# Altium project STMCUBE.PrjPCB
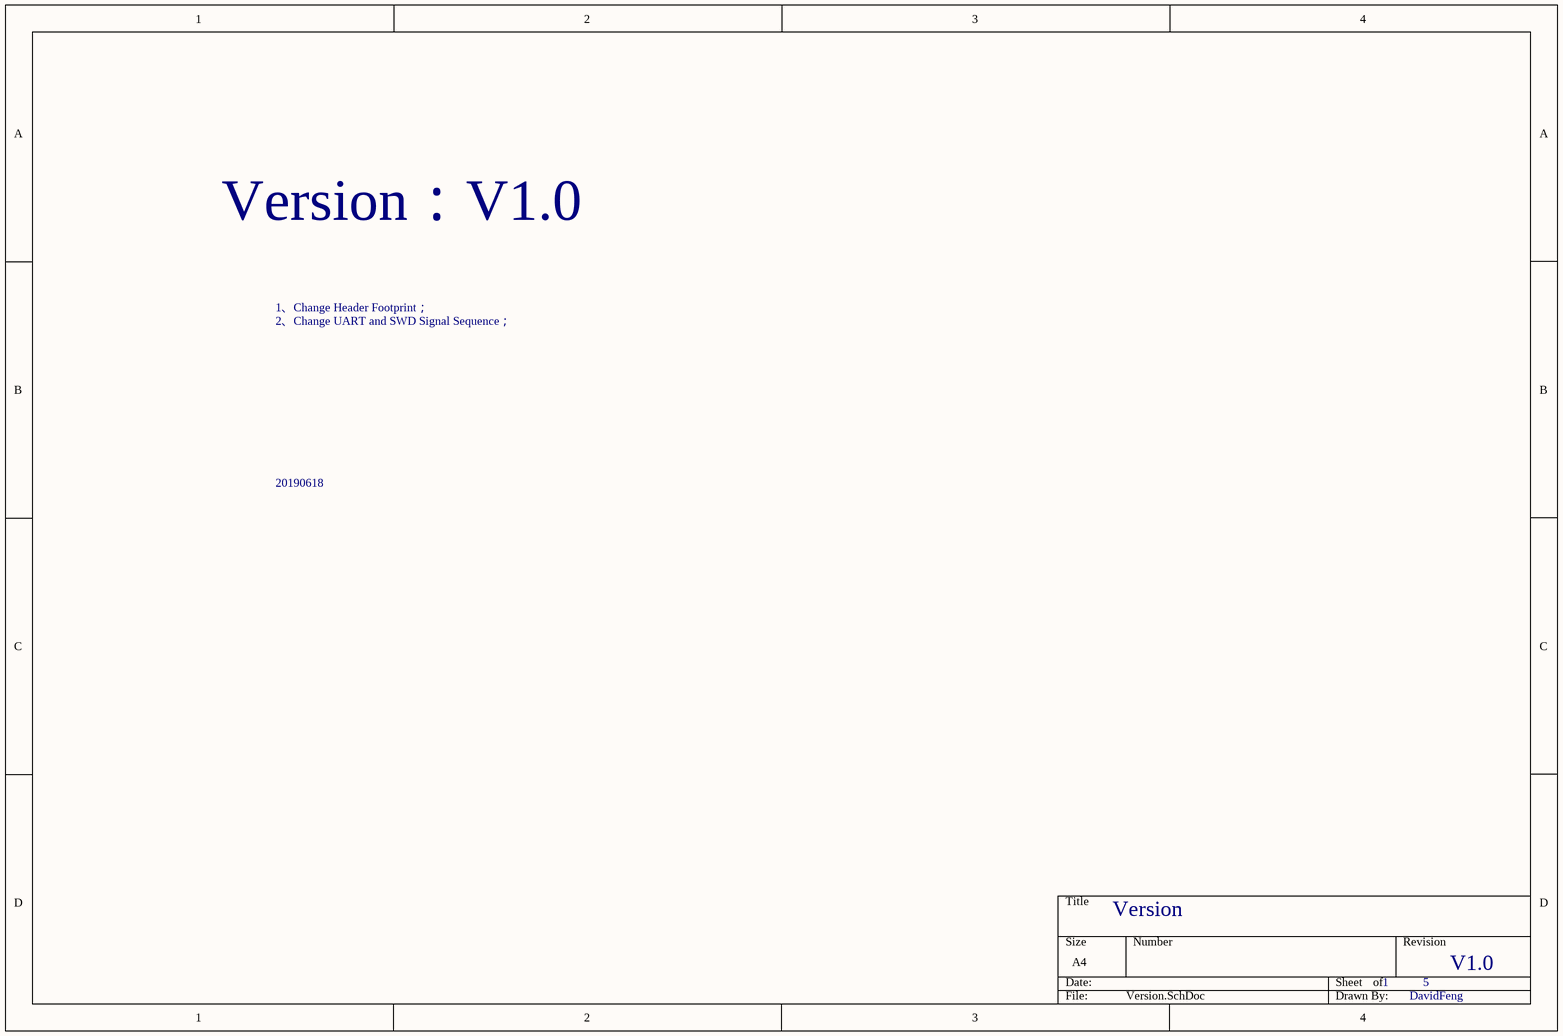
[diagram p0: Version.SchDoc]
5 sheets, 52 parts. Net scope: global (net labels, ports and power ports of the same name join across sheets).
Board file: STMCUBE.PcbDoc
Sheets:
  Version.SchDoc
  MCU.SchDoc
  POWER.SchDoc
  Peripheral.SchDoc
  Connectors.SchDoc

## Sheet Version.SchDoc
size A4

### Notes on the sheet
- Version：V1.0
- 1、Change Header Footprint；
- 2、Change UART and SWD Signal Sequence；
- 20190618
- Version
- 1
- 5
- V1.0
- DavidFeng

## Sheet MCU.SchDoc
size A3
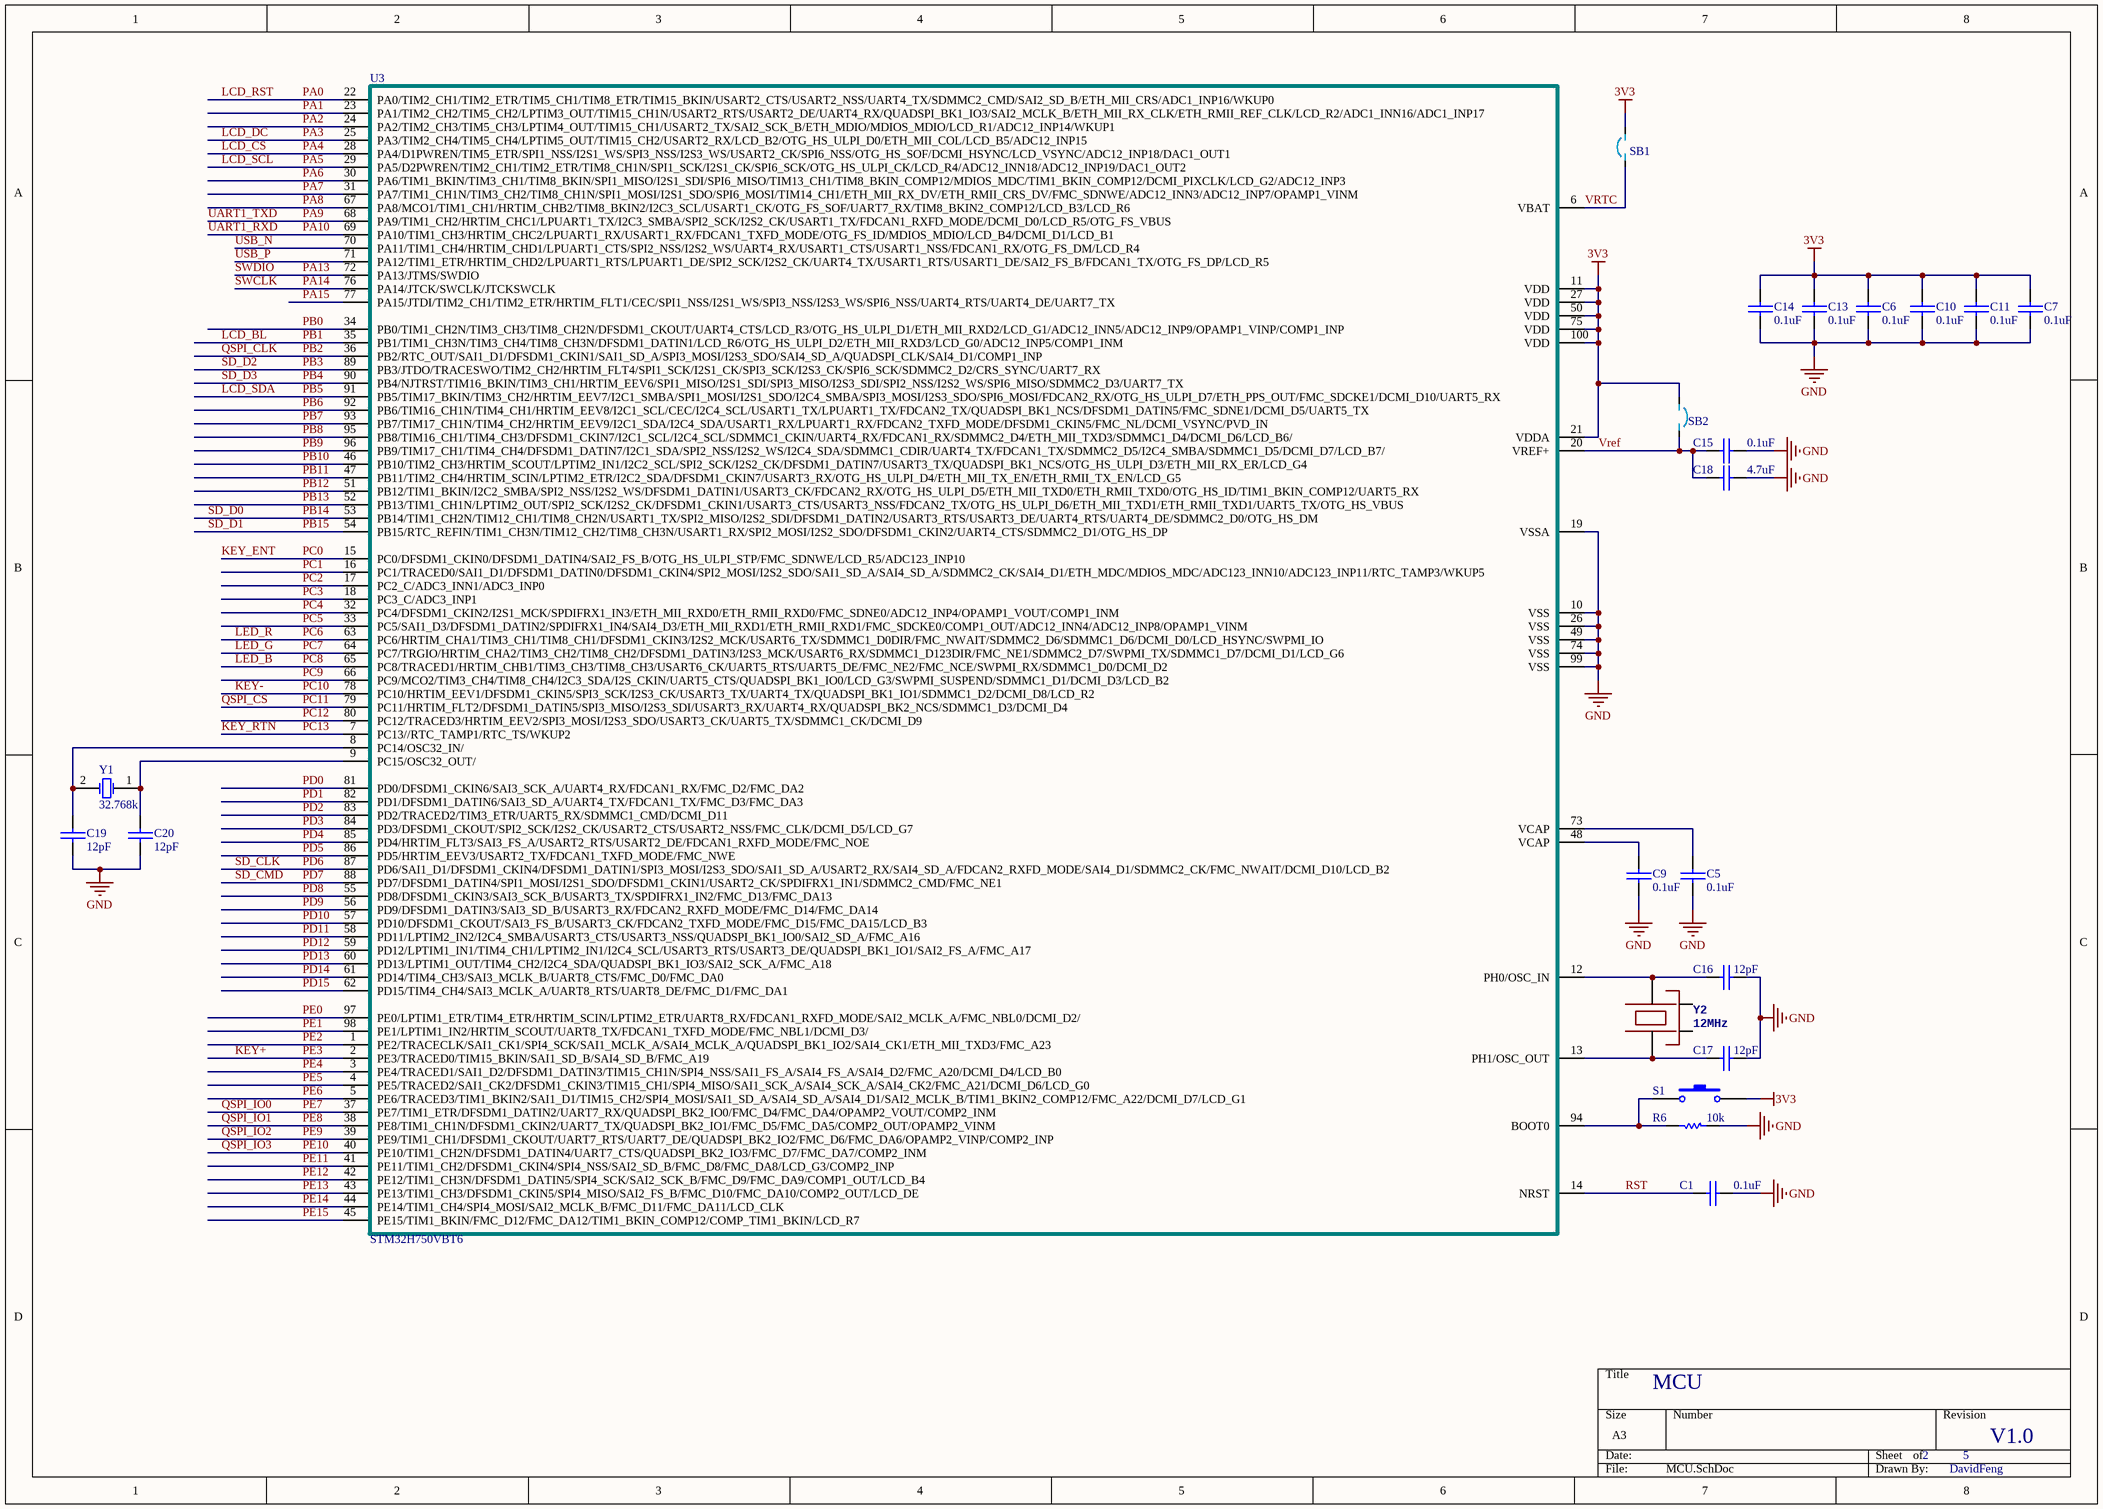
[diagram p1: MCU.SchDoc]

### Parts
C1  0.1uF  [C0603]
C5  0.1uF  [C0603]
C6  0.1uF  [C0603]
C7  0.1uF  [C0603]
C9  0.1uF  [C0603]
C10  0.1uF  [C0603]
C11  0.1uF  [C0603]
C13  0.1uF  [C0603]
C14  0.1uF  [C0603]
C15  0.1uF  [C0603]
C16  12pF  [C0603]
C17  12pF  [C0603]
C18  4.7uF  [C0805]
C19  12pF  [C0603]
C20  12pF  [C0603]
R6  10k  [R0603]
S1  SW-PB  [SW_4X7_2P]  (value not drawn)
SB1  Jumper  [SB0603]  (value not drawn)
SB2  Jumper  [SB0603]  (value not drawn)
U3  STM32H750VBT6  [TQFP-100]
Y1  32.768k  [FC-135]
Y2  12MHz  [SMD-3225]

### Nets
3V3: C6.1 C7.1 C10.2 C11.1 C13.2 C14.2 S1.2 SB1.1 SB2.2 U3.11(VDD) U3.21(VDDA) U3.27(VDD) U3.50(VDD) U3.75(VDD) U3.100(VDD)
GND: C1.2 C5.2 C6.2 C7.2 C9.2 C10.1 C11.2 C13.1 C14.1 C15.2 C16.1 C17.1 C18.2 C19.1 C20.1 R6.2 U3.10(VSS) U3.19(VSSA) U3.26(VSS) U3.49(VSS) U3.74(VSS) U3.99(VSS)
KEY+: U3.2(PE3/TRACED0/TIM15_BKIN/SAI1_SD_B/SAI4_SD_B/FMC_A19)  [also labelled PE3]
KEY-: U3.78(PC10/HRTIM_EEV1/DFSDM1_CKIN5/SPI3_SCK/I2S3_CK/USART3_TX/UART4_TX/QUADSPI_BK1_IO1/SDMMC1_D2/DCMI_D8/LCD_R2)  [also labelled PC10]
KEY_ENT: U3.15(PC0/DFSDM1_CKIN0/DFSDM1_DATIN4/SAI2_FS_B/OTG_HS_ULPI_STP/FMC_SDNWE/LCD_R5/ADC123_INP10)  [also labelled PC0]
KEY_RTN: U3.7(PC13//RTC_TAMP1/RTC_TS/WKUP2)  [also labelled PC13]
LCD_BL: U3.35(PB1/TIM1_CH3N/TIM3_CH4/TIM8_CH3N/DFSDM1_DATIN1/LCD_R6/OTG_HS_ULPI_D2/ETH_MII_RXD3/LCD_G0/ADC12_INP5/COMP1_INM)  [also labelled PB1]
LCD_CS: U3.28(PA4/D1PWREN/TIM5_ETR/SPI1_NSS/I2S1_WS/SPI3_NSS/I2S3_WS/USART2_CK/SPI6_NSS/OTG_HS_SOF/DCMI_HSYNC/LCD_VSYNC/ADC12_INP18/DAC1_OUT1)  [also labelled PA4]
LCD_DC: U3.25(PA3/TIM2_CH4/TIM5_CH4/LPTIM5_OUT/TIM15_CH2/USART2_RX/LCD_B2/OTG_HS_ULPI_D0/ETH_MII_COL/LCD_B5/ADC12_INP15)  [also labelled PA3]
LCD_RST: U3.22(PA0/TIM2_CH1/TIM2_ETR/TIM5_CH1/TIM8_ETR/TIM15_BKIN/USART2_CTS/USART2_NSS/UART4_TX/SDMMC2_CMD/SAI2_SD_B/ETH_MII_CRS/ADC1_INP16/WKUP0)  [also labelled PA0]
LCD_SCL: U3.29(PA5/D2PWREN/TIM2_CH1/TIM2_ETR/TIM8_CH1N/SPI1_SCK/I2S1_CK/SPI6_SCK/OTG_HS_ULPI_CK/LCD_R4/ADC12_INN18/ADC12_INP19/DAC1_OUT2)  [also labelled PA5]
LCD_SDA: U3.91(PB5/TIM17_BKIN/TIM3_CH2/HRTIM_EEV7/I2C1_SMBA/SPI1_MOSI/I2S1_SDO/I2C4_SMBA/SPI3_MOSI/I2S3_SDO/SPI6_MOSI/FDCAN2_RX/OTG_HS_ULPI_D7/ETH_PPS_OUT/FMC_SDCKE1/DCMI_D10/UART5_RX)  [also labelled PB5]
LED_B: U3.65(PC8/TRACED1/HRTIM_CHB1/TIM3_CH3/TIM8_CH3/USART6_CK/UART5_RTS/UART5_DE/FMC_NE2/FMC_NCE/SWPMI_RX/SDMMC1_D0/DCMI_D2)  [also labelled PC8]
LED_G: U3.64(PC7/TRGIO/HRTIM_CHA2/TIM3_CH2/TIM8_CH2/DFSDM1_DATIN3/I2S3_MCK/USART6_RX/SDMMC1_D123DIR/FMC_NE1/SDMMC2_D7/SWPMI_TX/SDMMC1_D7/DCMI_D1/LCD_G6)  [also labelled PC7]
LED_R: U3.63(PC6/HRTIM_CHA1/TIM3_CH1/TIM8_CH1/DFSDM1_CKIN3/I2S2_MCK/USART6_TX/SDMMC1_D0DIR/FMC_NWAIT/SDMMC2_D6/SDMMC1_D6/DCMI_D0/LCD_HSYNC/SWPMI_IO)  [also labelled PC6]
PA1: U3.23(PA1/TIM2_CH2/TIM5_CH2/LPTIM3_OUT/TIM15_CH1N/USART2_RTS/USART2_DE/UART4_RX/QUADSPI_BK1_IO3/SAI2_MCLK_B/ETH_MII_RX_CLK/ETH_RMII_REF_CLK/LCD_R2/ADC1_INN16/ADC1_INP17)
PA2: U3.24(PA2/TIM2_CH3/TIM5_CH3/LPTIM4_OUT/TIM15_CH1/USART2_TX/SAI2_SCK_B/ETH_MDIO/MDIOS_MDIO/LCD_R1/ADC12_INP14/WKUP1)
PA6: U3.30(PA6/TIM1_BKIN/TIM3_CH1/TIM8_BKIN/SPI1_MISO/I2S1_SDI/SPI6_MISO/TIM13_CH1/TIM8_BKIN_COMP12/MDIOS_MDC/TIM1_BKIN_COMP12/DCMI_PIXCLK/LCD_G2/ADC12_INP3)
PA7: U3.31(PA7/TIM1_CH1N/TIM3_CH2/TIM8_CH1N/SPI1_MOSI/I2S1_SDO/SPI6_MOSI/TIM14_CH1/ETH_MII_RX_DV/ETH_RMII_CRS_DV/FMC_SDNWE/ADC12_INN3/ADC12_INP7/OPAMP1_VINM)
PA8: U3.67(PA8/MCO1/TIM1_CH1/HRTIM_CHB2/TIM8_BKIN2/I2C3_SCL/USART1_CK/OTG_FS_SOF/UART7_RX/TIM8_BKIN2_COMP12/LCD_B3/LCD_R6)
PA9: U3.68(PA9/TIM1_CH2/HRTIM_CHC1/LPUART1_TX/I2C3_SMBA/SPI2_SCK/I2S2_CK/USART1_TX/FDCAN1_RXFD_MODE/DCMI_D0/LCD_R5/OTG_FS_VBUS)  [also labelled UART1_TXD]
PA10: U3.69(PA10/TIM1_CH3/HRTIM_CHC2/LPUART1_RX/USART1_RX/FDCAN1_TXFD_MODE/OTG_FS_ID/MDIOS_MDIO/LCD_B4/DCMI_D1/LCD_B1)  [also labelled UART1_RXD]
PA13: U3.72(PA13/JTMS/SWDIO)  [also labelled SWDIO]
PA14: U3.76(PA14/JTCK/SWCLK/JTCKSWCLK)  [also labelled SWCLK]
PA15: U3.77(PA15/JTDI/TIM2_CH1/TIM2_ETR/HRTIM_FLT1/CEC/SPI1_NSS/I2S1_WS/SPI3_NSS/I2S3_WS/SPI6_NSS/UART4_RTS/UART4_DE/UART7_TX)
PB0: U3.34(PB0/TIM1_CH2N/TIM3_CH3/TIM8_CH2N/DFSDM1_CKOUT/UART4_CTS/LCD_R3/OTG_HS_ULPI_D1/ETH_MII_RXD2/LCD_G1/ADC12_INN5/ADC12_INP9/OPAMP1_VINP/COMP1_INP)
PB2: U3.36(PB2/RTC_OUT/SAI1_D1/DFSDM1_CKIN1/SAI1_SD_A/SPI3_MOSI/I2S3_SDO/SAI4_SD_A/QUADSPI_CLK/SAI4_D1/COMP1_INP)  [also labelled QSPI_CLK]
PB3: U3.89(PB3/JTDO/TRACESWO/TIM2_CH2/HRTIM_FLT4/SPI1_SCK/I2S1_CK/SPI3_SCK/I2S3_CK/SPI6_SCK/SDMMC2_D2/CRS_SYNC/UART7_RX)  [also labelled SD_D2]
PB4: U3.90(PB4/NJTRST/TIM16_BKIN/TIM3_CH1/HRTIM_EEV6/SPI1_MISO/I2S1_SDI/SPI3_MISO/I2S3_SDI/SPI2_NSS/I2S2_WS/SPI6_MISO/SDMMC2_D3/UART7_TX)  [also labelled SD_D3]
PB6: U3.92(PB6/TIM16_CH1N/TIM4_CH1/HRTIM_EEV8/I2C1_SCL/CEC/I2C4_SCL/USART1_TX/LPUART1_TX/FDCAN2_TX/QUADSPI_BK1_NCS/DFSDM1_DATIN5/FMC_SDNE1/DCMI_D5/UART5_TX)
PB7: U3.93(PB7/TIM17_CH1N/TIM4_CH2/HRTIM_EEV9/I2C1_SDA/I2C4_SDA/USART1_RX/LPUART1_RX/FDCAN2_TXFD_MODE/DFSDM1_CKIN5/FMC_NL/DCMI_VSYNC/PVD_IN)
PB8: U3.95(PB8/TIM16_CH1/TIM4_CH3/DFSDM1_CKIN7/I2C1_SCL/I2C4_SCL/SDMMC1_CKIN/UART4_RX/FDCAN1_RX/SDMMC2_D4/ETH_MII_TXD3/SDMMC1_D4/DCMI_D6/LCD_B6/)
PB9: U3.96(PB9/TIM17_CH1/TIM4_CH4/DFSDM1_DATIN7/I2C1_SDA/SPI2_NSS/I2S2_WS/I2C4_SDA/SDMMC1_CDIR/UART4_TX/FDCAN1_TX/SDMMC2_D5/I2C4_SMBA/SDMMC1_D5/DCMI_D7/LCD_B7/)
PB10: U3.46(PB10/TIM2_CH3/HRTIM_SCOUT/LPTIM2_IN1/I2C2_SCL/SPI2_SCK/I2S2_CK/DFSDM1_DATIN7/USART3_TX/QUADSPI_BK1_NCS/OTG_HS_ULPI_D3/ETH_MII_RX_ER/LCD_G4)
PB11: U3.47(PB11/TIM2_CH4/HRTIM_SCIN/LPTIM2_ETR/I2C2_SDA/DFSDM1_CKIN7/USART3_RX/OTG_HS_ULPI_D4/ETH_MII_TX_EN/ETH_RMII_TX_EN/LCD_G5)
PB12: U3.51(PB12/TIM1_BKIN/I2C2_SMBA/SPI2_NSS/I2S2_WS/DFSDM1_DATIN1/USART3_CK/FDCAN2_RX/OTG_HS_ULPI_D5/ETH_MII_TXD0/ETH_RMII_TXD0/OTG_HS_ID/TIM1_BKIN_COMP12/UART5_RX)
PB13: U3.52(PB13/TIM1_CH1N/LPTIM2_OUT/SPI2_SCK/I2S2_CK/DFSDM1_CKIN1/USART3_CTS/USART3_NSS/FDCAN2_TX/OTG_HS_ULPI_D6/ETH_MII_TXD1/ETH_RMII_TXD1/UART5_TX/OTG_HS_VBUS)
PB14: U3.53(PB14/TIM1_CH2N/TIM12_CH1/TIM8_CH2N/USART1_TX/SPI2_MISO/I2S2_SDI/DFSDM1_DATIN2/USART3_RTS/USART3_DE/UART4_RTS/UART4_DE/SDMMC2_D0/OTG_HS_DM)  [also labelled SD_D0]
PB15: U3.54(PB15/RTC_REFIN/TIM1_CH3N/TIM12_CH2/TIM8_CH3N/USART1_RX/SPI2_MOSI/I2S2_SDO/DFSDM1_CKIN2/UART4_CTS/SDMMC2_D1/OTG_HS_DP)  [also labelled SD_D1]
PC1: U3.16(PC1/TRACED0/SAI1_D1/DFSDM1_DATIN0/DFSDM1_CKIN4/SPI2_MOSI/I2S2_SDO/SAI1_SD_A/SAI4_SD_A/SDMMC2_CK/SAI4_D1/ETH_MDC/MDIOS_MDC/ADC123_INN10/ADC123_INP11/RTC_TAMP3/WKUP5)
PC2: U3.17(PC2_C/ADC3_INN1/ADC3_INP0)
PC3: U3.18(PC3_C/ADC3_INP1)
PC4: U3.32(PC4/DFSDM1_CKIN2/I2S1_MCK/SPDIFRX1_IN3/ETH_MII_RXD0/ETH_RMII_RXD0/FMC_SDNE0/ADC12_INP4/OPAMP1_VOUT/COMP1_INM)
PC5: U3.33(PC5/SAI1_D3/DFSDM1_DATIN2/SPDIFRX1_IN4/SAI4_D3/ETH_MII_RXD1/ETH_RMII_RXD1/FMC_SDCKE0/COMP1_OUT/ADC12_INN4/ADC12_INP8/OPAMP1_VINM)
PC9: U3.66(PC9/MCO2/TIM3_CH4/TIM8_CH4/I2C3_SDA/I2S_CKIN/UART5_CTS/QUADSPI_BK1_IO0/LCD_G3/SWPMI_SUSPEND/SDMMC1_D1/DCMI_D3/LCD_B2)
PC11: U3.79(PC11/HRTIM_FLT2/DFSDM1_DATIN5/SPI3_MISO/I2S3_SDI/USART3_RX/UART4_RX/QUADSPI_BK2_NCS/SDMMC1_D3/DCMI_D4)  [also labelled QSPI_CS]
PC12: U3.80(PC12/TRACED3/HRTIM_EEV2/SPI3_MOSI/I2S3_SDO/USART3_CK/UART5_TX/SDMMC1_CK/DCMI_D9)
PD0: U3.81(PD0/DFSDM1_CKIN6/SAI3_SCK_A/UART4_RX/FDCAN1_RX/FMC_D2/FMC_DA2)
PD1: U3.82(PD1/DFSDM1_DATIN6/SAI3_SD_A/UART4_TX/FDCAN1_TX/FMC_D3/FMC_DA3)
PD2: U3.83(PD2/TRACED2/TIM3_ETR/UART5_RX/SDMMC1_CMD/DCMI_D11)
PD3: U3.84(PD3/DFSDM1_CKOUT/SPI2_SCK/I2S2_CK/USART2_CTS/USART2_NSS/FMC_CLK/DCMI_D5/LCD_G7)
PD4: U3.85(PD4/HRTIM_FLT3/SAI3_FS_A/USART2_RTS/USART2_DE/FDCAN1_RXFD_MODE/FMC_NOE)
PD5: U3.86(PD5/HRTIM_EEV3/USART2_TX/FDCAN1_TXFD_MODE/FMC_NWE)
PD6: U3.87(PD6/SAI1_D1/DFSDM1_CKIN4/DFSDM1_DATIN1/SPI3_MOSI/I2S3_SDO/SAI1_SD_A/USART2_RX/SAI4_SD_A/FDCAN2_RXFD_MODE/SAI4_D1/SDMMC2_CK/FMC_NWAIT/DCMI_D10/LCD_B2)  [also labelled SD_CLK]
PD7: U3.88(PD7/DFSDM1_DATIN4/SPI1_MOSI/I2S1_SDO/DFSDM1_CKIN1/USART2_CK/SPDIFRX1_IN1/SDMMC2_CMD/FMC_NE1)  [also labelled SD_CMD]
PD8: U3.55(PD8/DFSDM1_CKIN3/SAI3_SCK_B/USART3_TX/SPDIFRX1_IN2/FMC_D13/FMC_DA13)
PD9: U3.56(PD9/DFSDM1_DATIN3/SAI3_SD_B/USART3_RX/FDCAN2_RXFD_MODE/FMC_D14/FMC_DA14)
PD10: U3.57(PD10/DFSDM1_CKOUT/SAI3_FS_B/USART3_CK/FDCAN2_TXFD_MODE/FMC_D15/FMC_DA15/LCD_B3)
PD11: U3.58(PD11/LPTIM2_IN2/I2C4_SMBA/USART3_CTS/USART3_NSS/QUADSPI_BK1_IO0/SAI2_SD_A/FMC_A16)
PD12: U3.59(PD12/LPTIM1_IN1/TIM4_CH1/LPTIM2_IN1/I2C4_SCL/USART3_RTS/USART3_DE/QUADSPI_BK1_IO1/SAI2_FS_A/FMC_A17)
PD13: U3.60(PD13/LPTIM1_OUT/TIM4_CH2/I2C4_SDA/QUADSPI_BK1_IO3/SAI2_SCK_A/FMC_A18)
PD14: U3.61(PD14/TIM4_CH3/SAI3_MCLK_B/UART8_CTS/FMC_D0/FMC_DA0)
PD15: U3.62(PD15/TIM4_CH4/SAI3_MCLK_A/UART8_RTS/UART8_DE/FMC_D1/FMC_DA1)
PE0: U3.97(PE0/LPTIM1_ETR/TIM4_ETR/HRTIM_SCIN/LPTIM2_ETR/UART8_RX/FDCAN1_RXFD_MODE/SAI2_MCLK_A/FMC_NBL0/DCMI_D2/)
PE1: U3.98(PE1/LPTIM1_IN2/HRTIM_SCOUT/UART8_TX/FDCAN1_TXFD_MODE/FMC_NBL1/DCMI_D3/)
PE2: U3.1(PE2/TRACECLK/SAI1_CK1/SPI4_SCK/SAI1_MCLK_A/SAI4_MCLK_A/QUADSPI_BK1_IO2/SAI4_CK1/ETH_MII_TXD3/FMC_A23)
PE4: U3.3(PE4/TRACED1/SAI1_D2/DFSDM1_DATIN3/TIM15_CH1N/SPI4_NSS/SAI1_FS_A/SAI4_FS_A/SAI4_D2/FMC_A20/DCMI_D4/LCD_B0)
PE5: U3.4(PE5/TRACED2/SAI1_CK2/DFSDM1_CKIN3/TIM15_CH1/SPI4_MISO/SAI1_SCK_A/SAI4_SCK_A/SAI4_CK2/FMC_A21/DCMI_D6/LCD_G0)
PE6: U3.5(PE6/TRACED3/TIM1_BKIN2/SAI1_D1/TIM15_CH2/SPI4_MOSI/SAI1_SD_A/SAI4_SD_A/SAI4_D1/SAI2_MCLK_B/TIM1_BKIN2_COMP12/FMC_A22/DCMI_D7/LCD_G1)
PE7: U3.37(PE7/TIM1_ETR/DFSDM1_DATIN2/UART7_RX/QUADSPI_BK2_IO0/FMC_D4/FMC_DA4/OPAMP2_VOUT/COMP2_INM)  [also labelled QSPI_IO0]
PE8: U3.38(PE8/TIM1_CH1N/DFSDM1_CKIN2/UART7_TX/QUADSPI_BK2_IO1/FMC_D5/FMC_DA5/COMP2_OUT/OPAMP2_VINM)  [also labelled QSPI_IO1]
PE9: U3.39(PE9/TIM1_CH1/DFSDM1_CKOUT/UART7_RTS/UART7_DE/QUADSPI_BK2_IO2/FMC_D6/FMC_DA6/OPAMP2_VINP/COMP2_INP)  [also labelled QSPI_IO2]
PE10: U3.40(PE10/TIM1_CH2N/DFSDM1_DATIN4/UART7_CTS/QUADSPI_BK2_IO3/FMC_D7/FMC_DA7/COMP2_INM)  [also labelled QSPI_IO3]
PE11: U3.41(PE11/TIM1_CH2/DFSDM1_CKIN4/SPI4_NSS/SAI2_SD_B/FMC_D8/FMC_DA8/LCD_G3/COMP2_INP)
PE12: U3.42(PE12/TIM1_CH3N/DFSDM1_DATIN5/SPI4_SCK/SAI2_SCK_B/FMC_D9/FMC_DA9/COMP1_OUT/LCD_B4)
PE13: U3.43(PE13/TIM1_CH3/DFSDM1_CKIN5/SPI4_MISO/SAI2_FS_B/FMC_D10/FMC_DA10/COMP2_OUT/LCD_DE)
PE14: U3.44(PE14/TIM1_CH4/SPI4_MOSI/SAI2_MCLK_B/FMC_D11/FMC_DA11/LCD_CLK)
PE15: U3.45(PE15/TIM1_BKIN/FMC_D12/FMC_DA12/TIM1_BKIN_COMP12/COMP_TIM1_BKIN/LCD_R7)
RST: C1.1 U3.14(NRST)
USB_N: U3.70(PA11/TIM1_CH4/HRTIM_CHD1/LPUART1_CTS/SPI2_NSS/I2S2_WS/UART4_RX/USART1_CTS/USART1_NSS/FDCAN1_RX/OTG_FS_DM/LCD_R4)
USB_P: U3.71(PA12/TIM1_ETR/HRTIM_CHD2/LPUART1_RTS/LPUART1_DE/SPI2_SCK/I2S2_CK/UART4_TX/USART1_RTS/USART1_DE/SAI2_FS_B/FDCAN1_TX/OTG_FS_DP/LCD_R5)
Vref: C15.1 C18.1 SB2.1 U3.20(VREF+)
VRTC: SB1.2 U3.6(VBAT)
NetC5_1: C5.1 U3.73(VCAP)
NetC9_1: C9.1 U3.48(VCAP)
NetC16_2: C16.2 U3.12(PH0/OSC_IN) Y2.3
NetC17_2: C17.2 U3.13(PH1/OSC_OUT) Y2.1
NetC19_2: C19.2 U3.8(PC14/OSC32_IN/) Y1.2(OSC2)
NetC20_2: C20.2 U3.9(PC15/OSC32_OUT/) Y1.1(OSC1)
NetR6_1: R6.1 S1.1 U3.94(BOOT0)

Not connected (* = marked no-connect by the designer): Y2 2(NC_2) 4(NC_4)

### Notes on the sheet
- MCU
- 2
- 5
- V1.0
- DavidFeng

### Library data of the parts
C1 C5-C7 C9-C11 C13-C20 = CAP: Capacitor
R6 = Res1: Resistor; Value: 1K; Published: 8-Jun-2000; LatestRevisionDate: 17-Jul-2002; LatestRevisionNote: Re-released for DXP Platform.; PackageReference: AXIAL-0.3; Publisher: Altium Limited
S1 = SW-PB: Switch; Published: 24-Mar-1999; LatestRevisionDate: 17-Jul-2002; LatestRevisionNote: Re-released for DXP Platform.; PackageReference: SPST-2; Publisher: Altium Limited
SB1 SB2 = SB
U3 = STM32H750Vx
Y1 = XTAL: Crystal Oscillator; Published: 8-Jun-2000; LatestRevisionDate: 17-Jul-2002; LatestRevisionNote: Re-released for DXP Platform.; PackageReference: R38; Publisher: Altium Limited
Y2 = XTAL-4Pin: CRYSTAL 24MHZ 8PF SMD

## Sheet POWER.SchDoc
size A4
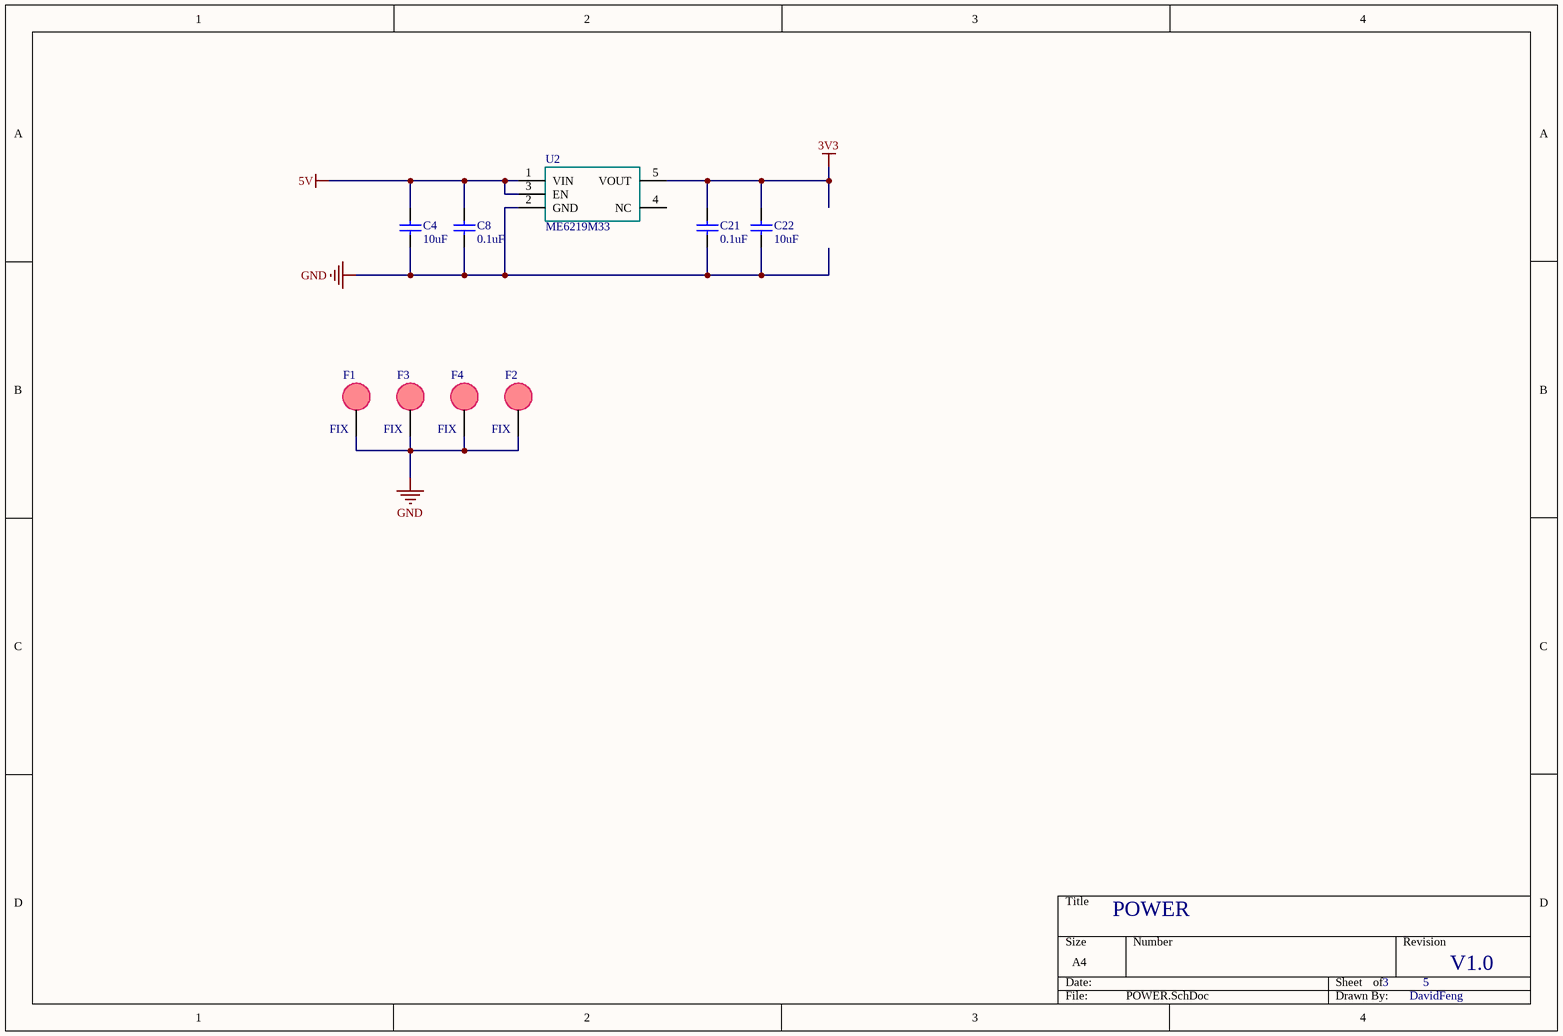
[diagram p2: POWER.SchDoc]

### Parts
C4  10uF  [C0805]
C8  0.1uF  [C0603]
C21  0.1uF  [C0603]
C22  10uF  [C0805]
F1  FIX  [FIX-2.0]
F2  FIX  [FIX-2.0]
F3  FIX  [FIX-2.0]
F4  FIX  [FIX-2.0]
U2  ME6219M33  [SOT23-5]

### Nets
3V3: C21.2 C22.2 U2.5(VOUT)
5V: C4.2 C8.2 U2.1(VIN) U2.3(EN)
GND: C4.1 C8.1 C21.1 C22.1 F1.0 F2.0 F3.0 F4.0 U2.2(GND)

Not connected (* = marked no-connect by the designer): U2 4(NC)

### Notes on the sheet
- POWER
- 3
- 5
- V1.0
- DavidFeng

### Library data of the parts
C4 C8 C21 C22 = Cap: Capacitor; Value: 100pF; Published: 8-Jun-2000; LatestRevisionDate: 17-Jul-2002; LatestRevisionNote: Re-released for DXP Platform.; PackageReference: RAD-0.3; Publisher: Altium Limited
U2 = ME6219: LOW-POWER 100-mA LOW-DROPOUT LINEAR REGULATORS

## Sheet Peripheral.SchDoc
size A4
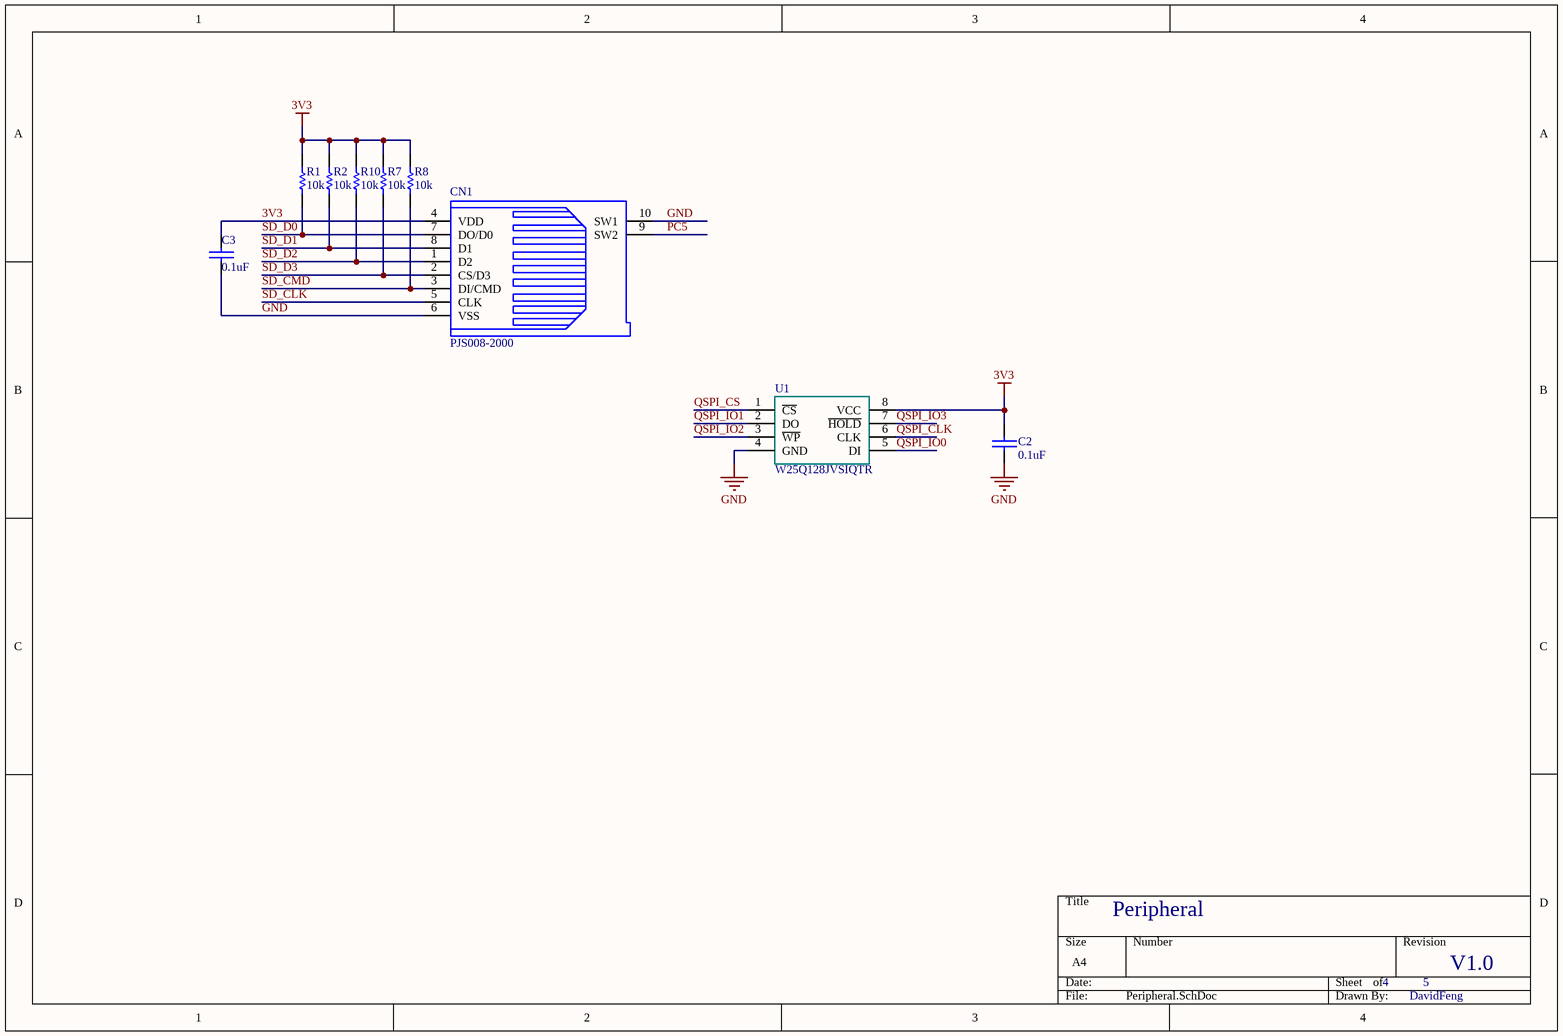
[diagram p3: Peripheral.SchDoc]

### Parts
C2  0.1uF  [c0603]
C3  0.1uF  [c0603]
CN1  PJS008-2000  [TF_CARD]
R1  10k  [R0603]
R2  10k  [R0603]
R7  10k  [R0603]
R8  10k  [R0603]
R10  10k  [R0603]
U1  W25Q128JVSIQTR  [SOIC127P800-8N]

### Nets
3V3: C2.1 C3.1 CN1.4(VDD) R1.1 R2.1 R7.1 R8.1 R10.1 U1.8(VCC)
GND: C2.2 C3.2 CN1.6(VSS) CN1.10(SW1) U1.4(GND)
PC5: CN1.9(SW2)
QSPI_CLK: U1.6(CLK)  [project net PB2]
QSPI_CS: U1.1(~{CS})  [project net PC11]
QSPI_IO0: U1.5(DI)  [project net PE7]
QSPI_IO1: U1.2(DO)  [project net PE8]
QSPI_IO2: U1.3(~{WP})  [project net PE9]
QSPI_IO3: U1.7(~{HOLD})  [project net PE10]
SD_CLK: CN1.5(CLK)  [project net PD6]
SD_CMD: CN1.3(DI/CMD) R8.2  [project net PD7]
SD_D0: CN1.7(DO/D0) R1.2  [project net PB14]
SD_D1: CN1.8(D1) R2.2  [project net PB15]
SD_D2: CN1.1(D2) R10.2  [project net PB3]
SD_D3: CN1.2(CS/D3) R7.2  [project net PB4]

### Notes on the sheet
- Peripheral
- 4
- 5
- V1.0
- DavidFeng

### Library data of the parts
C2 C3 = CAP: Capacitor
CN1 = TF_CARD
R1 R2 R7 R8 R10 = Res1: Resistor; Value: 1K; Published: 8-Jun-2000; LatestRevisionDate: 17-Jul-2002; LatestRevisionNote: Re-released for DXP Platform.; PackageReference: AXIAL-0.3; Publisher: Altium Limited
U1 = W25QXX: 64M-BIT  SERIAL FLASH MEMORY

## Sheet Connectors.SchDoc
size A4
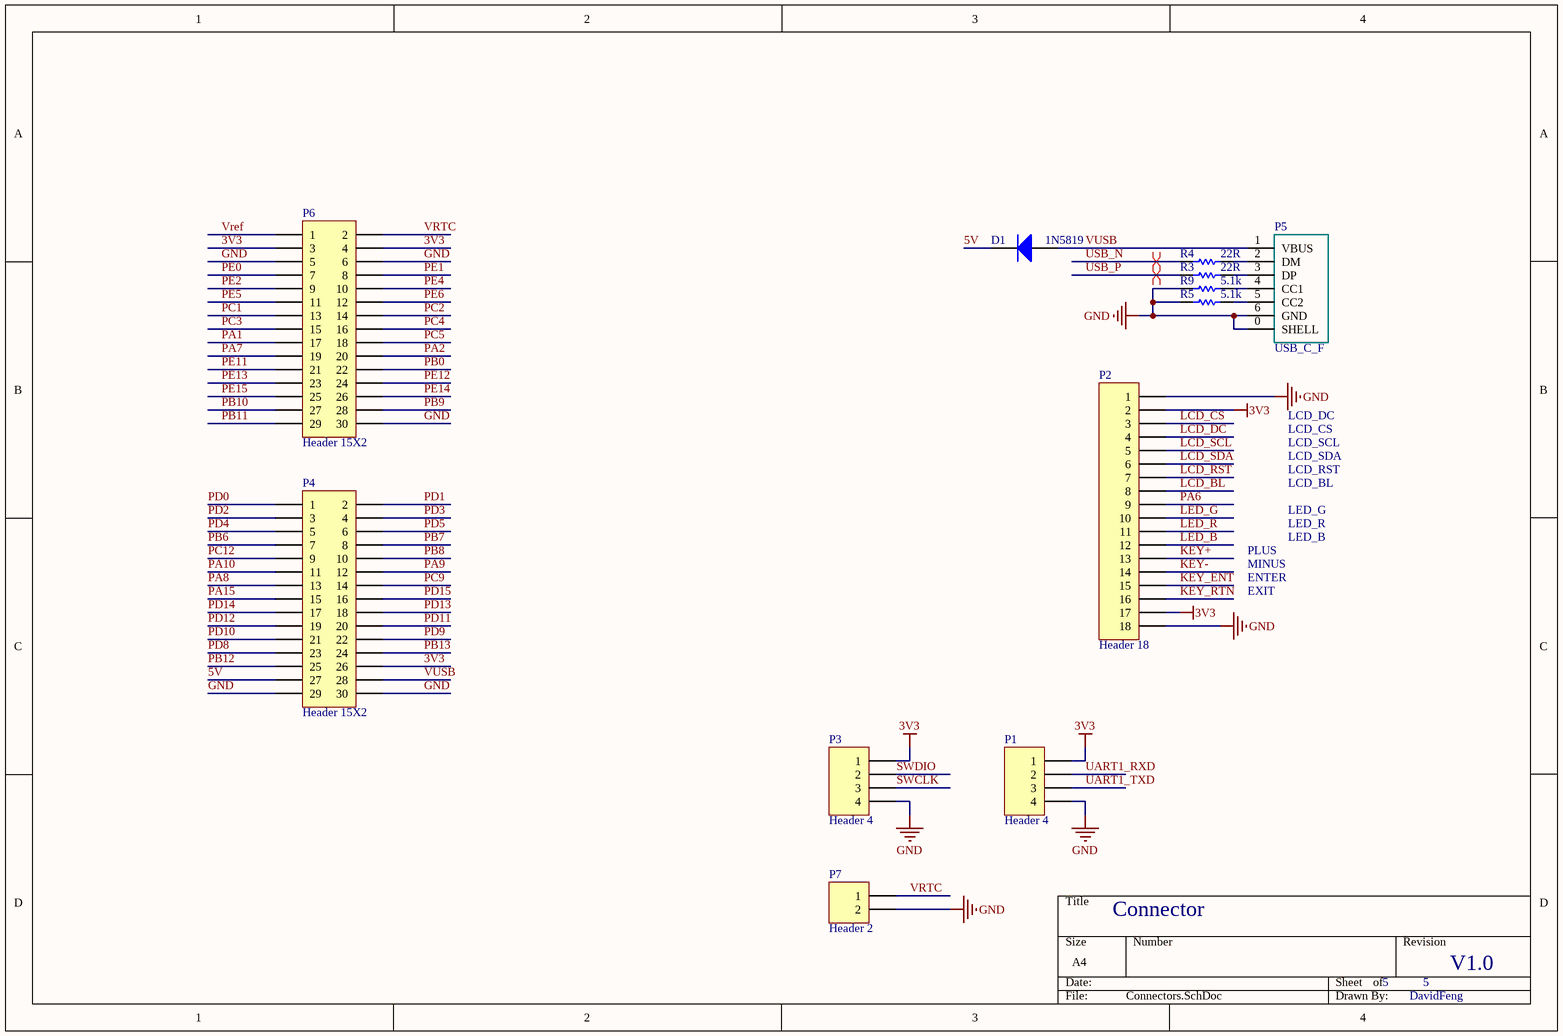
[diagram p4: Connectors.SchDoc]

### Parts
D1  1N5819  [SOD-123]
P1  Header 4  [SH1.27-4SW]
P2  Header 18  [FPC18-0.5]
P3  Header 4  [SH1.27-4SW]
P4  Header 15X2  [HDRH2.0-2X15]
P5  USB_C_F  [USB Type-C-F]
P6  Header 15X2  [HDRH2.0-2X15]
P7  Header 2  [SH-1.27-2AW]
R3  22R  [R0603]
R4  22R  [R0603]
R5  5.1k  [R0603]
R9  5.1k  [R0603]

### Nets
3V3: P1.1 P2.2 P2.17 P3.1 P4.26 P6.3 P6.4
5V: D1.2(K) P4.27
GND: P1.4 P2.1 P2.18 P3.4 P4.29 P4.30 P5.0(SHELL) P5.6(GND) P6.5 P6.6 P6.30 P7.2 R5.1 R9.1
KEY+: P2.13
KEY-: P2.14
KEY_ENT: P2.15
KEY_RTN: P2.16
LCD_BL: P2.8
LCD_CS: P2.3
LCD_DC: P2.4
LCD_RST: P2.7
LCD_SCL: P2.5
LCD_SDA: P2.6
LED_B: P2.12
LED_G: P2.10
LED_R: P2.11
PA1: P6.17
PA2: P6.20
PA6: P2.9
PA7: P6.19
PA8: P4.13
PA9: P1.3 P4.12  [also labelled UART1_TXD]
PA10: P1.2 P4.11  [also labelled UART1_RXD]
PA15: P4.15
PB0: P6.22
PB6: P4.7
PB7: P4.8
PB8: P4.10
PB9: P6.28
PB10: P6.27
PB11: P6.29
PB12: P4.25
PB13: P4.24
PC1: P6.13
PC2: P6.14
PC3: P6.15
PC4: P6.16
PC5: P6.18
PC9: P4.14
PC12: P4.9
PD0: P4.1
PD1: P4.2
PD2: P4.3
PD3: P4.4
PD4: P4.5
PD5: P4.6
PD8: P4.23
PD9: P4.22
PD10: P4.21
PD11: P4.20
PD12: P4.19
PD13: P4.18
PD14: P4.17
PD15: P4.16
PE0: P6.7
PE1: P6.8
PE2: P6.9
PE4: P6.10
PE5: P6.11
PE6: P6.12
PE11: P6.21
PE12: P6.24
PE13: P6.23
PE14: P6.26
PE15: P6.25
SWCLK: P3.3  [project net PA14]
SWDIO: P3.2  [project net PA13]
USB_N: R4.1
USB_P: R3.1
Vref: P6.1
VRTC: P6.2 P7.1
VUSB: D1.1(A) P4.28 P5.1(VBUS)
NetP5_2: P5.2(DM) R4.2
NetP5_3: P5.3(DP) R3.2
NetP5_4: P5.4(CC1) R9.2
NetP5_5: P5.5(CC2) R5.2

### Layout directives
differential pair: USB_N, USB_P

### Notes on the sheet
- LCD_DC
- LCD_CS
- LCD_SCL
- LCD_SDA
- LCD_RST
- LCD_BL
- LED_G
- PLUS
- MINUS
- ENTER
- LED_R
- LED_B
- EXIT
- Connector
- 5
- V1.0
- DavidFeng

### Library data of the parts
D1 = Diode: Default Diode; Published: 8-Jun-2000; LatestRevisionDate: 17-Jul-2002; LatestRevisionNote: Re-released for DXP Platform.; PackageVersion: Sep-1996; PackageReference: SMC; Publisher: Altium Limited; Code_JEDEC: DO-214-AB
P1 P3 = Header 4: Header, 4-Pin; LatestRevisionDate: 17-Jul-2002; LatestRevisionNote: Re-released for DXP Platform.; Publisher: Altium Limited
P2 = Header 18: Header, 18-Pin; LatestRevisionDate: 17-Jul-2002; LatestRevisionNote: Re-released for DXP Platform.; Publisher: Altium Limited
P4 P6 = Header 15X2: Header, 15-Pin, Dual row; LatestRevisionDate: 17-Jul-2002; LatestRevisionNote: Re-released for DXP Platform.; Publisher: Altium Limited
P7 = Header 2: Header, 2-Pin; LatestRevisionDate: 17-Jul-2002; LatestRevisionNote: Re-released for DXP Platform.; Publisher: Altium Limited
R3-R5 R9 = Res1: Resistor; Value: 22; Published: 8-Jun-2000; LatestRevisionDate: 17-Jul-2002; LatestRevisionNote: Re-released for DXP Platform.; PackageReference: AXIAL-0.3; Publisher: Altium Limited

## Nets that join several sheets
3V3: MCU (15 pins), POWER (C21.2 C22.2 U2.5), Peripheral (9 pins), Connectors (7 pins)
5V: POWER (C4.2 C8.2 U2.1 U2.3), Connectors (D1.2 P4.27)
GND: MCU (22 pins), POWER (9 pins), Peripheral (5 pins), Connectors (14 pins)
KEY+: MCU (U3.2), Connectors (P2.13)
KEY-: MCU (U3.78), Connectors (P2.14)
KEY_ENT: MCU (U3.15), Connectors (P2.15)
KEY_RTN: MCU (U3.7), Connectors (P2.16)
LCD_BL: MCU (U3.35), Connectors (P2.8)
LCD_CS: MCU (U3.28), Connectors (P2.3)
LCD_DC: MCU (U3.25), Connectors (P2.4)
LCD_RST: MCU (U3.22), Connectors (P2.7)
LCD_SCL: MCU (U3.29), Connectors (P2.5)
LCD_SDA: MCU (U3.91), Connectors (P2.6)
LED_B: MCU (U3.65), Connectors (P2.12)
LED_G: MCU (U3.64), Connectors (P2.10)
LED_R: MCU (U3.63), Connectors (P2.11)
PA1: MCU (U3.23), Connectors (P6.17)
PA2: MCU (U3.24), Connectors (P6.20)
PA6: MCU (U3.30), Connectors (P2.9)
PA7: MCU (U3.31), Connectors (P6.19)
PA8: MCU (U3.67), Connectors (P4.13)
PA9: MCU (U3.68), Connectors (P1.3 P4.12)
PA10: MCU (U3.69), Connectors (P1.2 P4.11)
PA13: MCU (U3.72), Connectors (P3.2)
PA14: MCU (U3.76), Connectors (P3.3)
PA15: MCU (U3.77), Connectors (P4.15)
PB0: MCU (U3.34), Connectors (P6.22)
PB2: MCU (U3.36), Peripheral (U1.6)
PB3: MCU (U3.89), Peripheral (CN1.1 R10.2)
PB4: MCU (U3.90), Peripheral (CN1.2 R7.2)
PB6: MCU (U3.92), Connectors (P4.7)
PB7: MCU (U3.93), Connectors (P4.8)
PB8: MCU (U3.95), Connectors (P4.10)
PB9: MCU (U3.96), Connectors (P6.28)
PB10: MCU (U3.46), Connectors (P6.27)
PB11: MCU (U3.47), Connectors (P6.29)
PB12: MCU (U3.51), Connectors (P4.25)
PB13: MCU (U3.52), Connectors (P4.24)
PB14: MCU (U3.53), Peripheral (CN1.7 R1.2)
PB15: MCU (U3.54), Peripheral (CN1.8 R2.2)
PC1: MCU (U3.16), Connectors (P6.13)
PC2: MCU (U3.17), Connectors (P6.14)
PC3: MCU (U3.18), Connectors (P6.15)
PC4: MCU (U3.32), Connectors (P6.16)
PC5: MCU (U3.33), Peripheral (CN1.9), Connectors (P6.18)
PC9: MCU (U3.66), Connectors (P4.14)
PC11: MCU (U3.79), Peripheral (U1.1)
PC12: MCU (U3.80), Connectors (P4.9)
PD0: MCU (U3.81), Connectors (P4.1)
PD1: MCU (U3.82), Connectors (P4.2)
PD2: MCU (U3.83), Connectors (P4.3)
PD3: MCU (U3.84), Connectors (P4.4)
PD4: MCU (U3.85), Connectors (P4.5)
PD5: MCU (U3.86), Connectors (P4.6)
PD6: MCU (U3.87), Peripheral (CN1.5)
PD7: MCU (U3.88), Peripheral (CN1.3 R8.2)
PD8: MCU (U3.55), Connectors (P4.23)
PD9: MCU (U3.56), Connectors (P4.22)
PD10: MCU (U3.57), Connectors (P4.21)
PD11: MCU (U3.58), Connectors (P4.20)
PD12: MCU (U3.59), Connectors (P4.19)
PD13: MCU (U3.60), Connectors (P4.18)
PD14: MCU (U3.61), Connectors (P4.17)
PD15: MCU (U3.62), Connectors (P4.16)
PE0: MCU (U3.97), Connectors (P6.7)
PE1: MCU (U3.98), Connectors (P6.8)
PE2: MCU (U3.1), Connectors (P6.9)
PE4: MCU (U3.3), Connectors (P6.10)
PE5: MCU (U3.4), Connectors (P6.11)
PE6: MCU (U3.5), Connectors (P6.12)
PE7: MCU (U3.37), Peripheral (U1.5)
PE8: MCU (U3.38), Peripheral (U1.2)
PE9: MCU (U3.39), Peripheral (U1.3)
PE10: MCU (U3.40), Peripheral (U1.7)
PE11: MCU (U3.41), Connectors (P6.21)
PE12: MCU (U3.42), Connectors (P6.24)
PE13: MCU (U3.43), Connectors (P6.23)
PE14: MCU (U3.44), Connectors (P6.26)
PE15: MCU (U3.45), Connectors (P6.25)
USB_N: MCU (U3.70), Connectors (R4.1)
USB_P: MCU (U3.71), Connectors (R3.1)
Vref: MCU (C15.1 C18.1 SB2.1 U3.20), Connectors (P6.1)
VRTC: MCU (SB1.2 U3.6), Connectors (P6.2 P7.1)